# Altium schematic sheet Iout.SchDoc
size A4; SheetNumber: 5; SheetTotal: 5
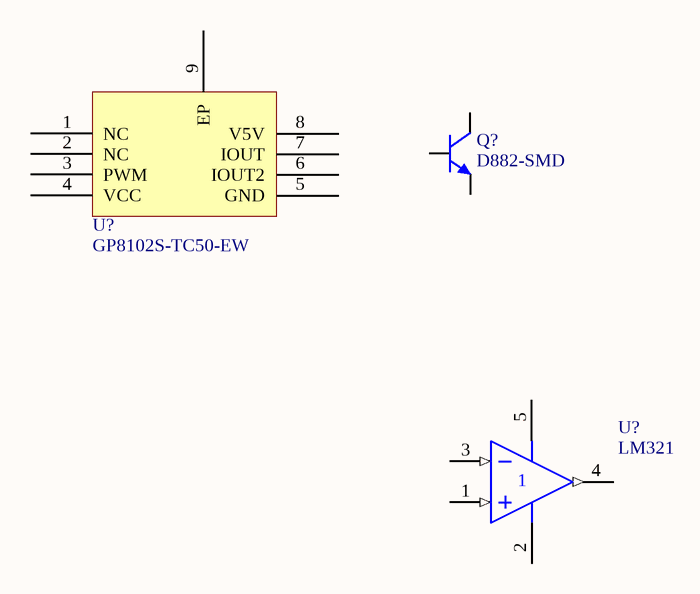
[diagram p0: Iout.SchDoc]

## Parts
(Parts that share a designator on the sheet are numbered #1, #2 ... from top to bottom, then left to right.)
Q?  D882-SMD  [SOT89_N]
U?#1  GP8102S-TC50-EW  [ESOP8_N]
U?#2  LM321  [SOT23-5N]

## Nets

Not connected (* = marked no-connect by the designer): Q? 1(B) 2(C) 3(E); U?#1 1(NC) 2(NC) 3(PWM) 4(VCC) 5(GND) 6(IOUT2) 7(IOUT) 8(V5V) 9(EP); U?#2 1(IN+) 2(V-) 3(IN-) 4(OUT) 5(V+)

## Library data of the parts
Q? = D882-SMD: 音频功放-NPN型; 版权归属: 源创客; 属性: 40V 3A 30W; BOM名称: 音频功放-NPN型; 学习资源: www.ooocke.com